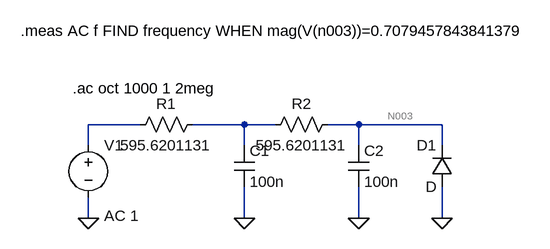
[diagram p0: schematic lpf_2nd_ord_1khz_cutoff.asc]
lpf_2nd_ord_1khz_cutoff.asc, the LTspice schematic file:
Version 4.1
SHEET 1 880 680
WIRE 48 112 -32 112
WIRE 208 112 128 112
WIRE 256 112 208 112
WIRE 384 112 336 112
WIRE 512 112 384 112
WIRE -32 144 -32 112
WIRE 208 144 208 112
WIRE 384 144 384 112
WIRE 512 144 512 112
WIRE -32 256 -32 224
WIRE 208 256 208 208
WIRE 384 256 384 208
WIRE 512 256 512 208
FLAG 208 256 0
FLAG -32 256 0
FLAG 384 256 0
FLAG 512 256 0
SYMBOL voltage -32 128 R0
WINDOW 3 24 152 Left 2
WINDOW 123 24 124 Left 2
WINDOW 39 0 0 Left 0
SYMATTR Value ""
SYMATTR Value2 AC 1
SYMATTR InstName V1
SYMBOL res 144 96 R90
WINDOW 0 0 56 VBottom 2
WINDOW 3 32 56 VTop 2
SYMATTR InstName R1
SYMATTR Value 595.6201131
SYMBOL cap 192 144 R0
SYMATTR InstName C1
SYMATTR Value 100n
SYMBOL res 352 96 R90
WINDOW 0 0 56 VBottom 2
WINDOW 3 32 56 VTop 2
SYMATTR InstName R2
SYMATTR Value 595.6201131
SYMBOL cap 368 144 R0
SYMATTR InstName C2
SYMATTR Value 100n
SYMBOL diode 528 208 R180
WINDOW 0 24 64 Left 2
WINDOW 3 24 0 Left 2
SYMATTR InstName D1
TEXT -56 56 Left 2 !.ac oct 1000 1 2meg
TEXT -136 -32 Left 2 !.meas AC f FIND frequency WHEN mag(V(n003))=0.7079457843841379

The netlist it stands for:
* lpf_2nd_ord_1khz_cutoff.asc
V1 N001 0 AC 1
R1 N002 N001 595.6201131
C1 N002 0 100n
R2 N003 N002 595.6201131
C2 N003 0 100n
D1 0 N003 D
.model D D
.lib standard.dio
.ac oct 1000 1 2meg
.meas AC f FIND frequency WHEN mag(V(n003))=0.7079457843841379
.backanno
.end